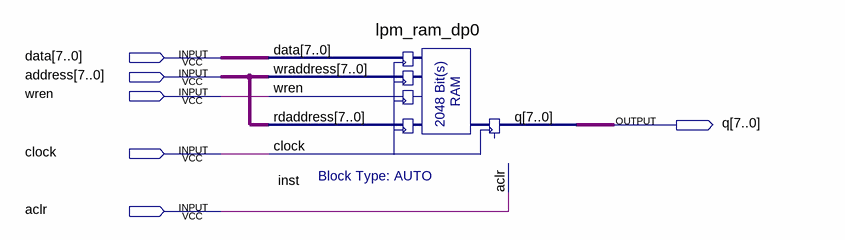
[diagram p0: schematic sheet]
// Quartus schematic lpm_ram_256_8.bdf as structural Verilog: 1 symbols, 6 pins
module lpm_ram_256_8 (
  input  [7:0] data,
  input  [7:0] address,
  input  wren,
  input  clock,
  input  aclr,
  output [7:0] q
);

  lpm_ram_dp0 inst (
    .data(data), .wraddress(address), .wren(wren), .rdaddress(address), .clock(clock), .aclr(aclr), .q(q));
endmodule
